# Altium schematic sheet smartGarden_Act_Rev01.SchDoc
size A
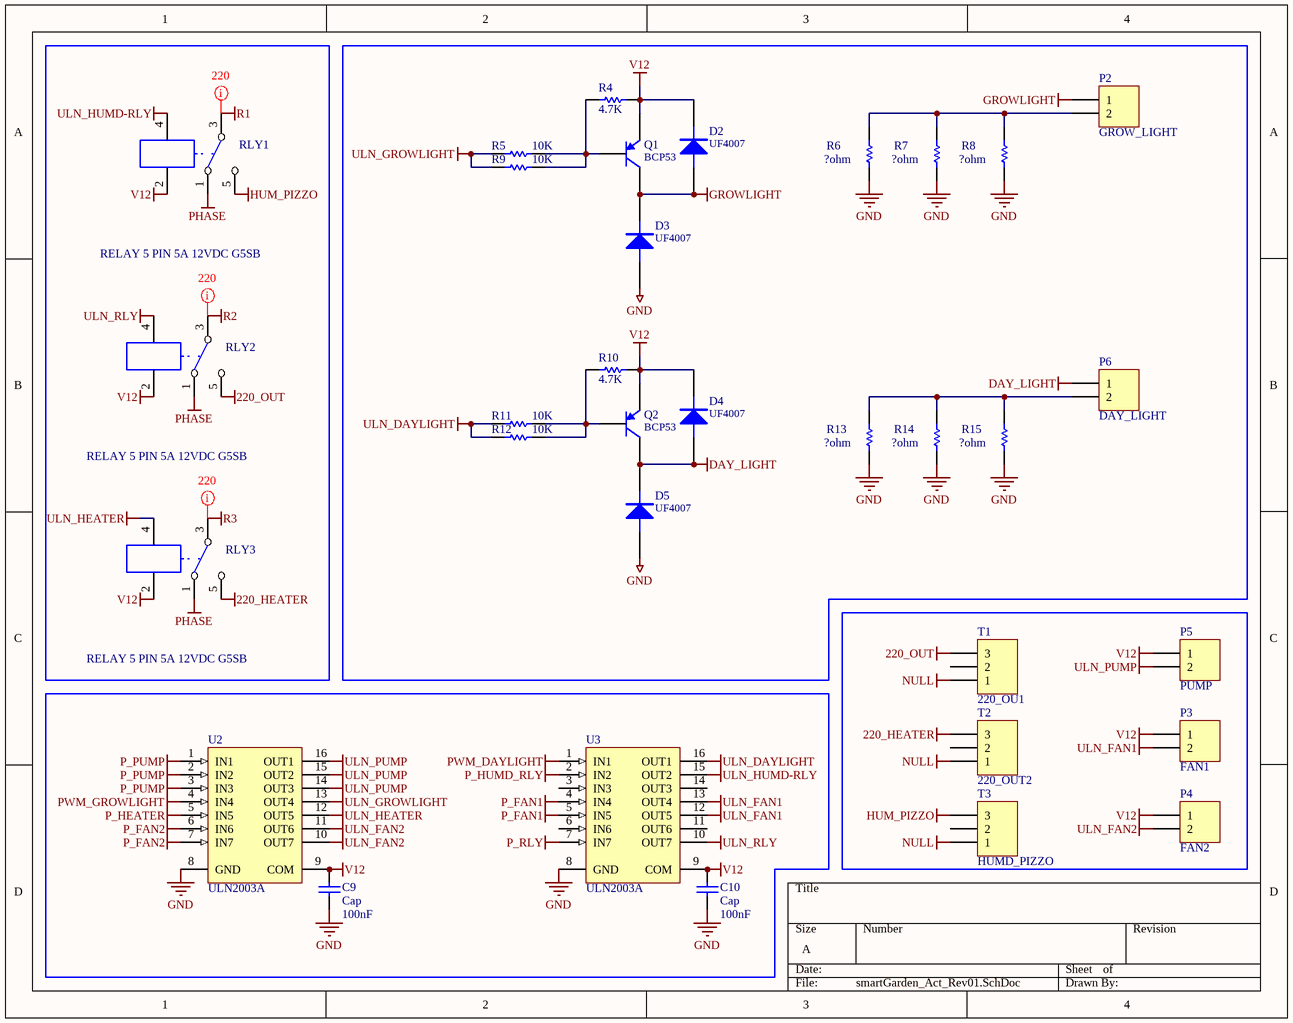
[diagram p0: smartGarden_Act_Rev01.SchDoc]

## Parts
C9  Cap  value 100nF  [0805_smd]
C10  Cap  value 100nF  [0805_smd]
D2  UF4007  [7227_SMD]
D3  UF4007  [7227_SMD]
D4  UF4007  [7227_SMD]
D5  UF4007  [7227_SMD]
P2  GROW_LIGHT  [PCON_L2]
P3  FAN1  [CON2_XH]
P4  FAN2  [CON2_XH]
P5  PUMP  [CON2_XH]
P6  DAY_LIGHT  [PCON_L2]
Q1  BCP53  [SOT223]
Q2  BCP53  [SOT223]
R4  4.7K  [0805_smd]
R5  10K  [1206_SMD]
R6  value ?ohm  [0805_smd]  (hidden comment: Res1)
R7  value ?ohm  [0805_smd]  (hidden comment: Res1)
R8  value ?ohm  [0805_smd]  (hidden comment: Res1)
R9  10K  [1206_SMD]
R10  4.7K  [0805_smd]
R11  10K  [1206_SMD]
R12  10K  [1206_SMD]
R13  value ?ohm  [0805_smd]  (hidden comment: Res1)
R14  value ?ohm  [0805_smd]  (hidden comment: Res1)
R15  value ?ohm  [0805_smd]  (hidden comment: Res1)
RLY1  RELAY 5 PIN 5A 12VDC G5SB  [RLY_G5S]
RLY2  RELAY 5 PIN 5A 12VDC G5SB  [RLY_G5S]
RLY3  RELAY 5 PIN 5A 12VDC G5SB  [RLY_G5S]
T1  220_OU1  [PCON_L3]
T2  220_OUT2  [PCON_L3]
T3  HUMD_PIZZO  [PCON_L3]
U2  ULN2003A  [SO-16_smd]
U3  ULN2003A  [SO-16_smd]

## Nets
220_HEATER: RLY3.5(NO) T2.3
220_OUT: RLY2.5(NO) T1.3
DAY_LIGHT: D4.A D5.K P6.1 Q2.2(C)
GND: C9.1 C10.1 D3.A D5.A R6.1 R7.1 R8.1 R13.1 R14.1 R15.1 U2.8(GND) U3.8(GND)
GROWLIGHT: D2.A D3.K P2.1 Q1.2(C)
HUM_PIZZO: RLY1.5(NO) T3.3
NULL: T1.1 T2.1 T3.1
P_FAN1: U3.4(IN4) U3.5(IN5)
P_FAN2: U2.6(IN6) U2.7(IN7)
P_HEATER: U2.5(IN5)
P_HUMD_RLY: U3.2(IN2)
P_PUMP: U2.1(IN1) U2.2(IN2) U2.3(IN3)
P_RLY: U3.7(IN7)
PHASE: RLY1.1(NC) RLY2.1(NC) RLY3.1(NC)
PWM_DAYLIGHT: U3.1(IN1)
PWM_GROWLIGHT: U2.4(IN4)
R1: RLY1.3(COM)
R2: RLY2.3(COM)
R3: RLY3.3(COM)
ULN_DAYLIGHT: R11.2 R12.2 U3.16(OUT1)
ULN_FAN1: P3.2 U3.12(OUT5) U3.13(OUT4)
ULN_FAN2: P4.2 U2.10(OUT7) U2.11(OUT6)
ULN_GROWLIGHT: R5.2 R9.2 U2.13(OUT4)
ULN_HEATER: RLY3.4(B) U2.12(OUT5)
ULN_HUMD-RLY: RLY1.4(B) U3.15(OUT2)
ULN_PUMP: P5.2 U2.14(OUT3) U2.15(OUT2) U2.16(OUT1)
ULN_RLY: RLY2.4(B) U3.10(OUT7)
V12: C9.2 C10.2 D2.K D4.K P3.1 P4.1 P5.1 Q1.3(E) Q2.3(E) R4.1 R10.1 RLY1.2(A) RLY2.2(A) RLY3.2(A) U2.9(COM) U3.9(COM)
NetP2_2: P2.2 R6.2 R7.2 R8.2
NetP6_2: P6.2 R13.2 R14.2 R15.2
NetQ1_1: Q1.1(B) R4.2 R5.1 R9.1
NetQ2_1: Q2.1(B) R10.2 R11.1 R12.1

Not connected (* = marked no-connect by the designer): T1 2; T2 2; T3 2; U3 3(IN3) 6(IN6) 11(OUT6) 14(OUT3)

## Layout directives
net class 220: R1, R2, R3

## Library data of the parts
C9 C10 = Cap: Capacitor; Published: 8-Jun-2000; LatestRevisionDate: 17-Jul-2002; LatestRevisionNote: Re-released for DXP Platform.; PackageReference: RAD-0.3; Publisher: Altium Limited; PackageDescription: Radial Cap, Thru-Hole; 2 Leads; 0.3 in Pin Spacing
D2-D5 = DIODE
P2-P6 = Header 2: Header, 2-Pin; LatestRevisionDate: 17-Jul-2002; LatestRevisionNote: Re-released for DXP Platform.; Publisher: Altium Limited
Q1 Q2 = 2N3906
R4 R5 R9-R12 = Res: Resistor; LatestRevisionNote: Re-released for DXP Platform.; PackageDescription: Axial Device, Thru-Hole; 2 Leads; 0.3 in Pin Spacing; PackageReference: AXIAL-0.3; Published: 8-Jun-2000; Publisher: Altium Limited; LatestRevisionDate: 17-Jul-2002
R6-R8 R13-R15 = Res1: Resistor; Published: 8-Jun-2000; LatestRevisionDate: 17-Jul-2002; LatestRevisionNote: Re-released for DXP Platform.; PackageReference: AXIAL-0.3; Publisher: Altium Limited; PackageDescription: Axial Device, Thru-Hole; 2 Leads; 0.3 in Pin Spacing
RLY1-RLY3 = RELAY-SPDT
T1-T3 = Header 3: Header, 3-Pin; LatestRevisionDate: 17-Jul-2002; LatestRevisionNote: Re-released for DXP Platform.; Publisher: Altium Limited
U2 U3 = ULN2004A: High-Voltage, High-Current Darlington Array; Published: 13-Oct-2000; LatestRevisionDate: 06-Jun-2005; LatestRevisionNote: Stylized 3D Model Added.; DatasheetVersion: 1998; PackageVersion: 1998; PackageReference: A16; Publisher: Altium Limited; PackageDescription: DIP; 16 Leads; Row Spacing 7.62 mm; Pitch 2.54 mm; Code_JEDEC: MS-001-BB; ComponentLink1Description: Manufacturer Link; ComponentLink1URL: http://www.allegromicro.com/